# Altium schematic sheet cSLIM-SA-LoRa.SchDoc
size 297 x 210 mm; SheetNumber: 3; SheetTotal: 12
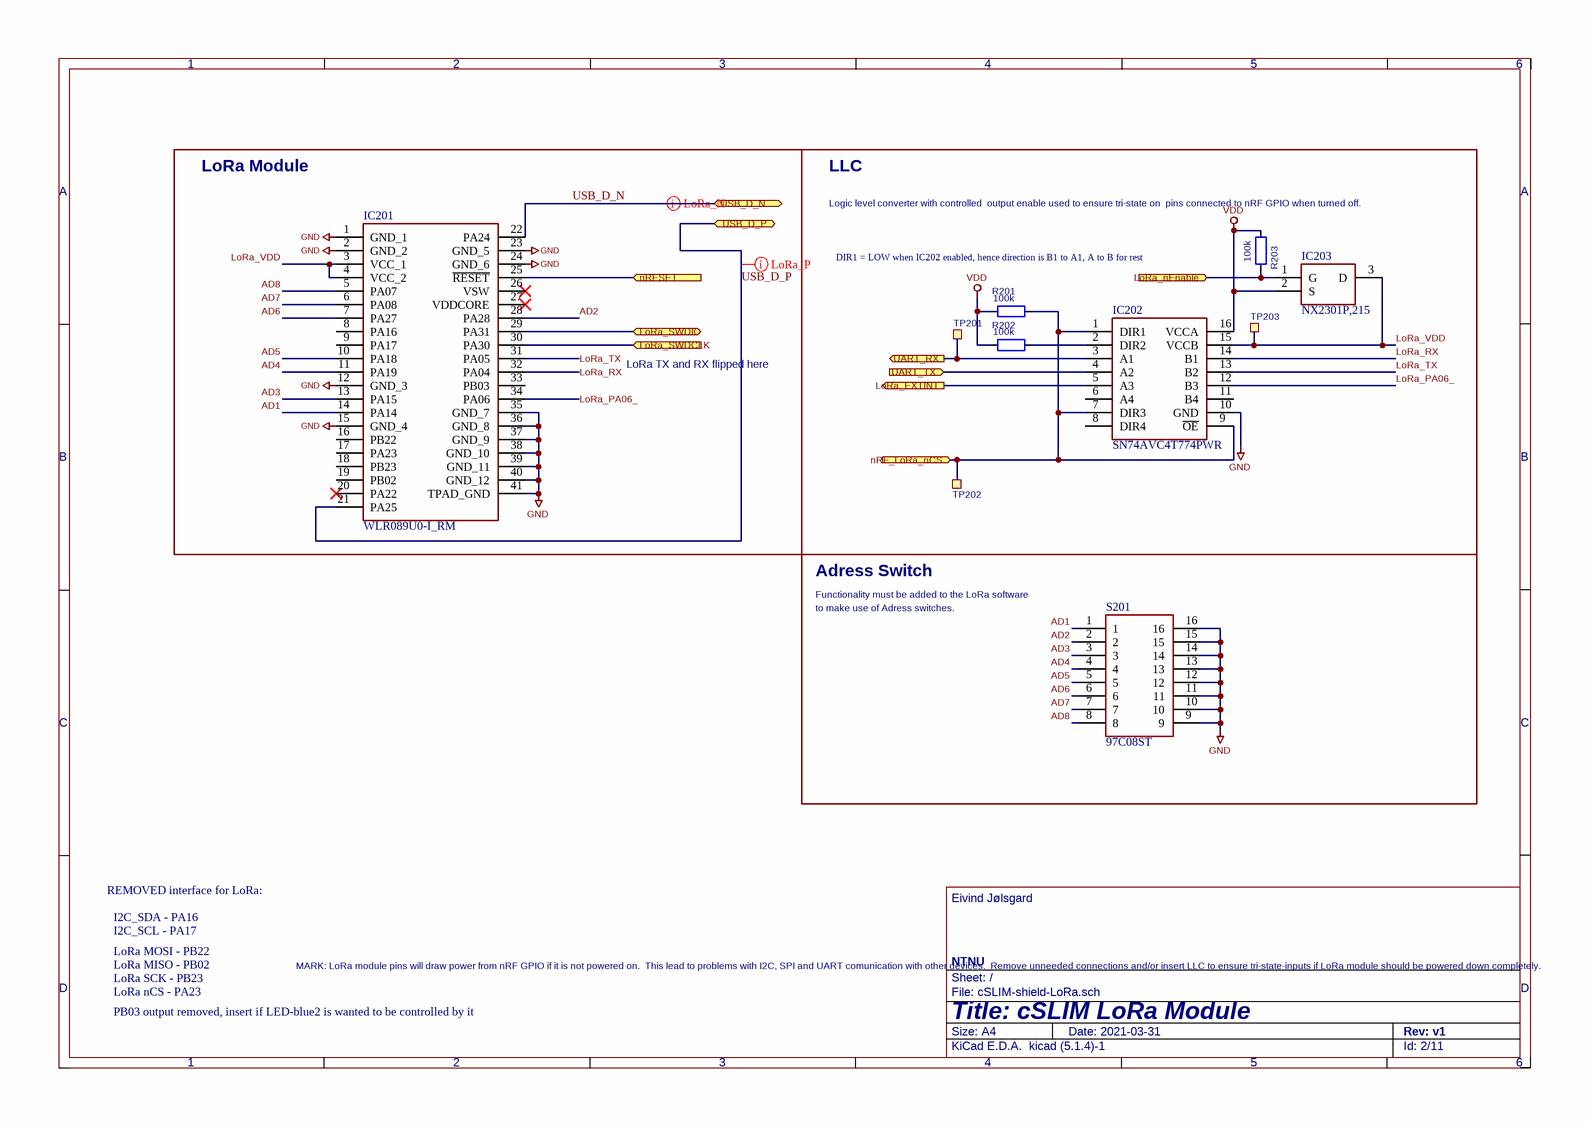
[diagram p0: cSLIM-SA-LoRa.SchDoc]

## Parts
IC201  WLR089U0-I_RM  [WLR089U0IRM]
IC202  SN74AVC4T774PWR  [SOP65P640X120-16N]
IC203  NX2301P,215  [SOT95P230X110-3N]
R201  100k  [RESC1608X55N]
R202  100k  [RESC1608X55N]
R203  100k  [RESC1608X55N]
S201  97C08ST  [SOIC127P671X170-16N]
TP201  (no value)  [TP_SMD_Ø1.0mm]  (no BOM)
TP202  (no value)  [TP_SMD_Ø1.0mm]  (no BOM)
TP203  (no value)  [TP_SMD_Ø1.0mm]  (no BOM)

## Blocks framed on the sheet
Adress Switch: S201

## Ports
LoRa_EXTINT (out), LoRa_nEnable (in), LoRa_SWDCLK (in), LoRa_SWDIO (bidir), nRESET (in), nRF_LoRa_nCS (in), UART_RX (out), UART_TX (in), USB_D_N (bidir), USB_D_P (bidir)

## Nets
GND: IC201.1(GND_1) IC201.2(GND_2) IC201.12(GND_3) IC201.15(GND_4) IC201.23(GND_5) IC201.24(GND_6) IC201.35(GND_7) IC201.36(GND_8) IC201.37(GND_9) IC201.38(GND_10) IC201.39(GND_11) IC201.40(GND_12) IC201.41(TPAD_GND) IC202.10(GND) S201.9 S201.10 S201.11 S201.12 S201.13 S201.14 S201.15 S201.16
VDD: IC202.16(VCCA) IC203.2(S) R201.2 R202.2 R203.2
AD1: IC201.14(PA14) S201.1
AD2: IC201.28(PA28) S201.2
AD3: IC201.13(PA15) S201.3
AD4: IC201.11(PA19) S201.4
AD5: IC201.10(PA18) S201.5
AD6: IC201.7(PA27) S201.6
AD7: IC201.6(PA08) S201.7
AD8: IC201.5(PA07) S201.8
LoRa_EXTINT: IC202.5(A3) ; port LoRa_EXTINT
LoRa_nEnable: IC203.1(G) R203.1 ; port LoRa_nEnable
LoRa_PA06_: IC201.34(PA06) IC202.12(B3)
LoRa_RX: IC201.32(PA04) IC202.14(B1)
LoRa_SWDCLK: IC201.30(PA30) ; port LoRa_SWDCLK
LoRa_SWDIO: IC201.29(PA31) ; port LoRa_SWDIO
LoRa_TX: IC201.31(PA05) IC202.13(B2)
LoRa_VDD: IC201.3(VCC_1) IC201.4(VCC_2) IC202.15(VCCB) IC203.3(D) TP203.1
nRESET: IC201.25(~{RESET}) ; port nRESET
nRF_LoRa_nCS: IC202.1(DIR1) IC202.7(DIR3) IC202.9(~{OE}) R201.1 TP202.1 ; port nRF_LoRa_nCS
UART_RX: IC202.3(A1) TP201.1 ; port UART_RX
UART_TX: IC202.4(A2) ; port UART_TX
USB_D_N: IC201.22(PA24) ; port USB_D_N
USB_D_P: IC201.21(PA25) ; port USB_D_P
NetIC202_2: IC202.2(DIR2) R202.1

Not connected (* = marked no-connect by the designer): IC201 8(PA16) 9(PA17) 16(PB22) 17(PA23) 18(PB23) 19(PB02) 20(PA22)* 26(VSW)* 27(VDDCORE)* 33(PB03); IC202 6(A4) 8(DIR4) 11(B4)

## Layout directives
differential pair: USB_D_N, USB_D_P

## Notes on the sheet
- LoRa Module
- (near R203) Logic level converter with controlled
  output enable used to ensure tri-state
  on  pins connected to nRF GPIO when turned off.
- LLC
- DIR1 = LOW when IC202 enabled, hence direction is B1 to A1, A to B for rest
- LoRa TX and RX flipped here
- Functionality must be added to the LoRa software
- to make use of Adress switches.
- REMOVED interface for LoRa:
- I2C_SDA - PA16
- I2C_SCL - PA17
- LoRa MOSI - PB22
- LoRa MISO - PB02
- LoRa SCK - PB23
- LoRa nCS - PA23
- PB03 output removed, insert if LED-blue2 is wanted to be controlled by it
- MARK: LoRa module pins will draw power from nRF GPIO if it is not powered on.
  This lead to problems with I2C, SPI and UART comunication with other devices.
  Remove unneeded connections and/or insert LLC to ensure tri-state-inputs if
  LoRa module should be powered down completely.
- 1
- 2
- 3
- 4
- 5
- 6
- A
- B
- C
- Eivind Jølsgard
- D
- Title: cSLIM LoRa Module
- File: cSLIM-shield-LoRa.sch
- Sheet: /
- NTNU
- KiCad E.D.A.  kicad (5.1.4)-1
- Size: A4
- Date: 2021-03-31
- Rev: v1
- Id: 2/11

## Library data of the parts
IC201 = WLR089U0-I_RM: Integrated Circuit; Manufacturer_Name: Microchip; Manufacturer_Part_Number: WLR089U0-I/RM; Datasheet Link: https://ww1.microchip.com/downloads/en/DeviceDoc/WLR089U0-Low-Power-LoRa-Sub-GHz-Module-Data-Sheet-DS70005435A.pdf; Height: 2.8mm; Mouser Part Number: 579-WLR089U0-I/RM; Mouser Price/Stock: https://www.mouser.co.uk/ProductDetail/Microchip-Technology/WLR089U0-I-RM?qs=W%2FMpXkg%252BdQ4sfSMsQUYuNg%3D%3D; Arrow Part Number: WLR089U0-I/RM; Arrow Price/Stock: https://www.arrow.com/en/products/wlr089u0-irm/microchip-technology
IC202 = SN74AVC4T774PWR: Integrated Circuit; Manufacturer_Name: Texas Instruments; Datasheet Link: http://www.ti.com/lit/gpn/sn74avc4t774; Height: 1.2mm; Manufacturer_Part_Number: SN74AVC4T774PWR; Mouser Part Number: 595-SN74AVC4T774PWR; Mouser Price/Stock: https://www.mouser.co.uk/ProductDetail/Texas-Instruments/SN74AVC4T774PWR?qs=WxL8HmPi5r562Eu%2F2kE2LA%3D%3D; Arrow Part Number: SN74AVC4T774PWR; Arrow Price/Stock: https://www.arrow.com/en/products/sn74avc4t774pwr/texas-instruments?region=nac
IC203 = NX2301P,215: Integrated Circuit; Manufacturer_Name: Nexperia; Datasheet Link: http://www.nxp.com/documents/data_sheet/NX2301P.pdf; Height: 1.1mm; Manufacturer_Part_Number: NX2301P,215; Mouser Part Number: 771-NX2301P215; Mouser Price/Stock: https://www.mouser.co.uk/ProductDetail/Nexperia/NX2301P215?qs=A1cBxND5mHKs%252BLrxCDENxw%3D%3D; Arrow Part Number: NX2301P,215; Arrow Price/Stock: https://www.arrow.com/en/products/nx2301p215/nexperia
R201-R203 = R: Value: 100k
S201 = 97C08ST: Switch; Manufacturer_Name: Grayhill; Datasheet Link: http://www.grayhill.com/search/?Keywords=97C08ST; Height: 1.7mm; Manufacturer_Part_Number: 97C08ST; Mouser Part Number: 706-97C08ST; Mouser Price/Stock: https://www.mouser.co.uk/ProductDetail/Grayhill/97C08ST?qs=ls7QRyWmRk6QAl4Hs3wGtw%3D%3D; Arrow Part Number: 97C08ST; Arrow Price/Stock: https://www.arrow.com/en/products/97c08st/grayhill
TP201-TP203 = TP